# EasyEDA schematic loud-esp-mini-rev-f-schematic.easyeda.json

## Sheets
1 MCU: TITLE: ESP32 audio development board mini; REV: F; Date: 2023-04-20; Sheet: 1/4; Drawn By: andriy@sonocotta.com
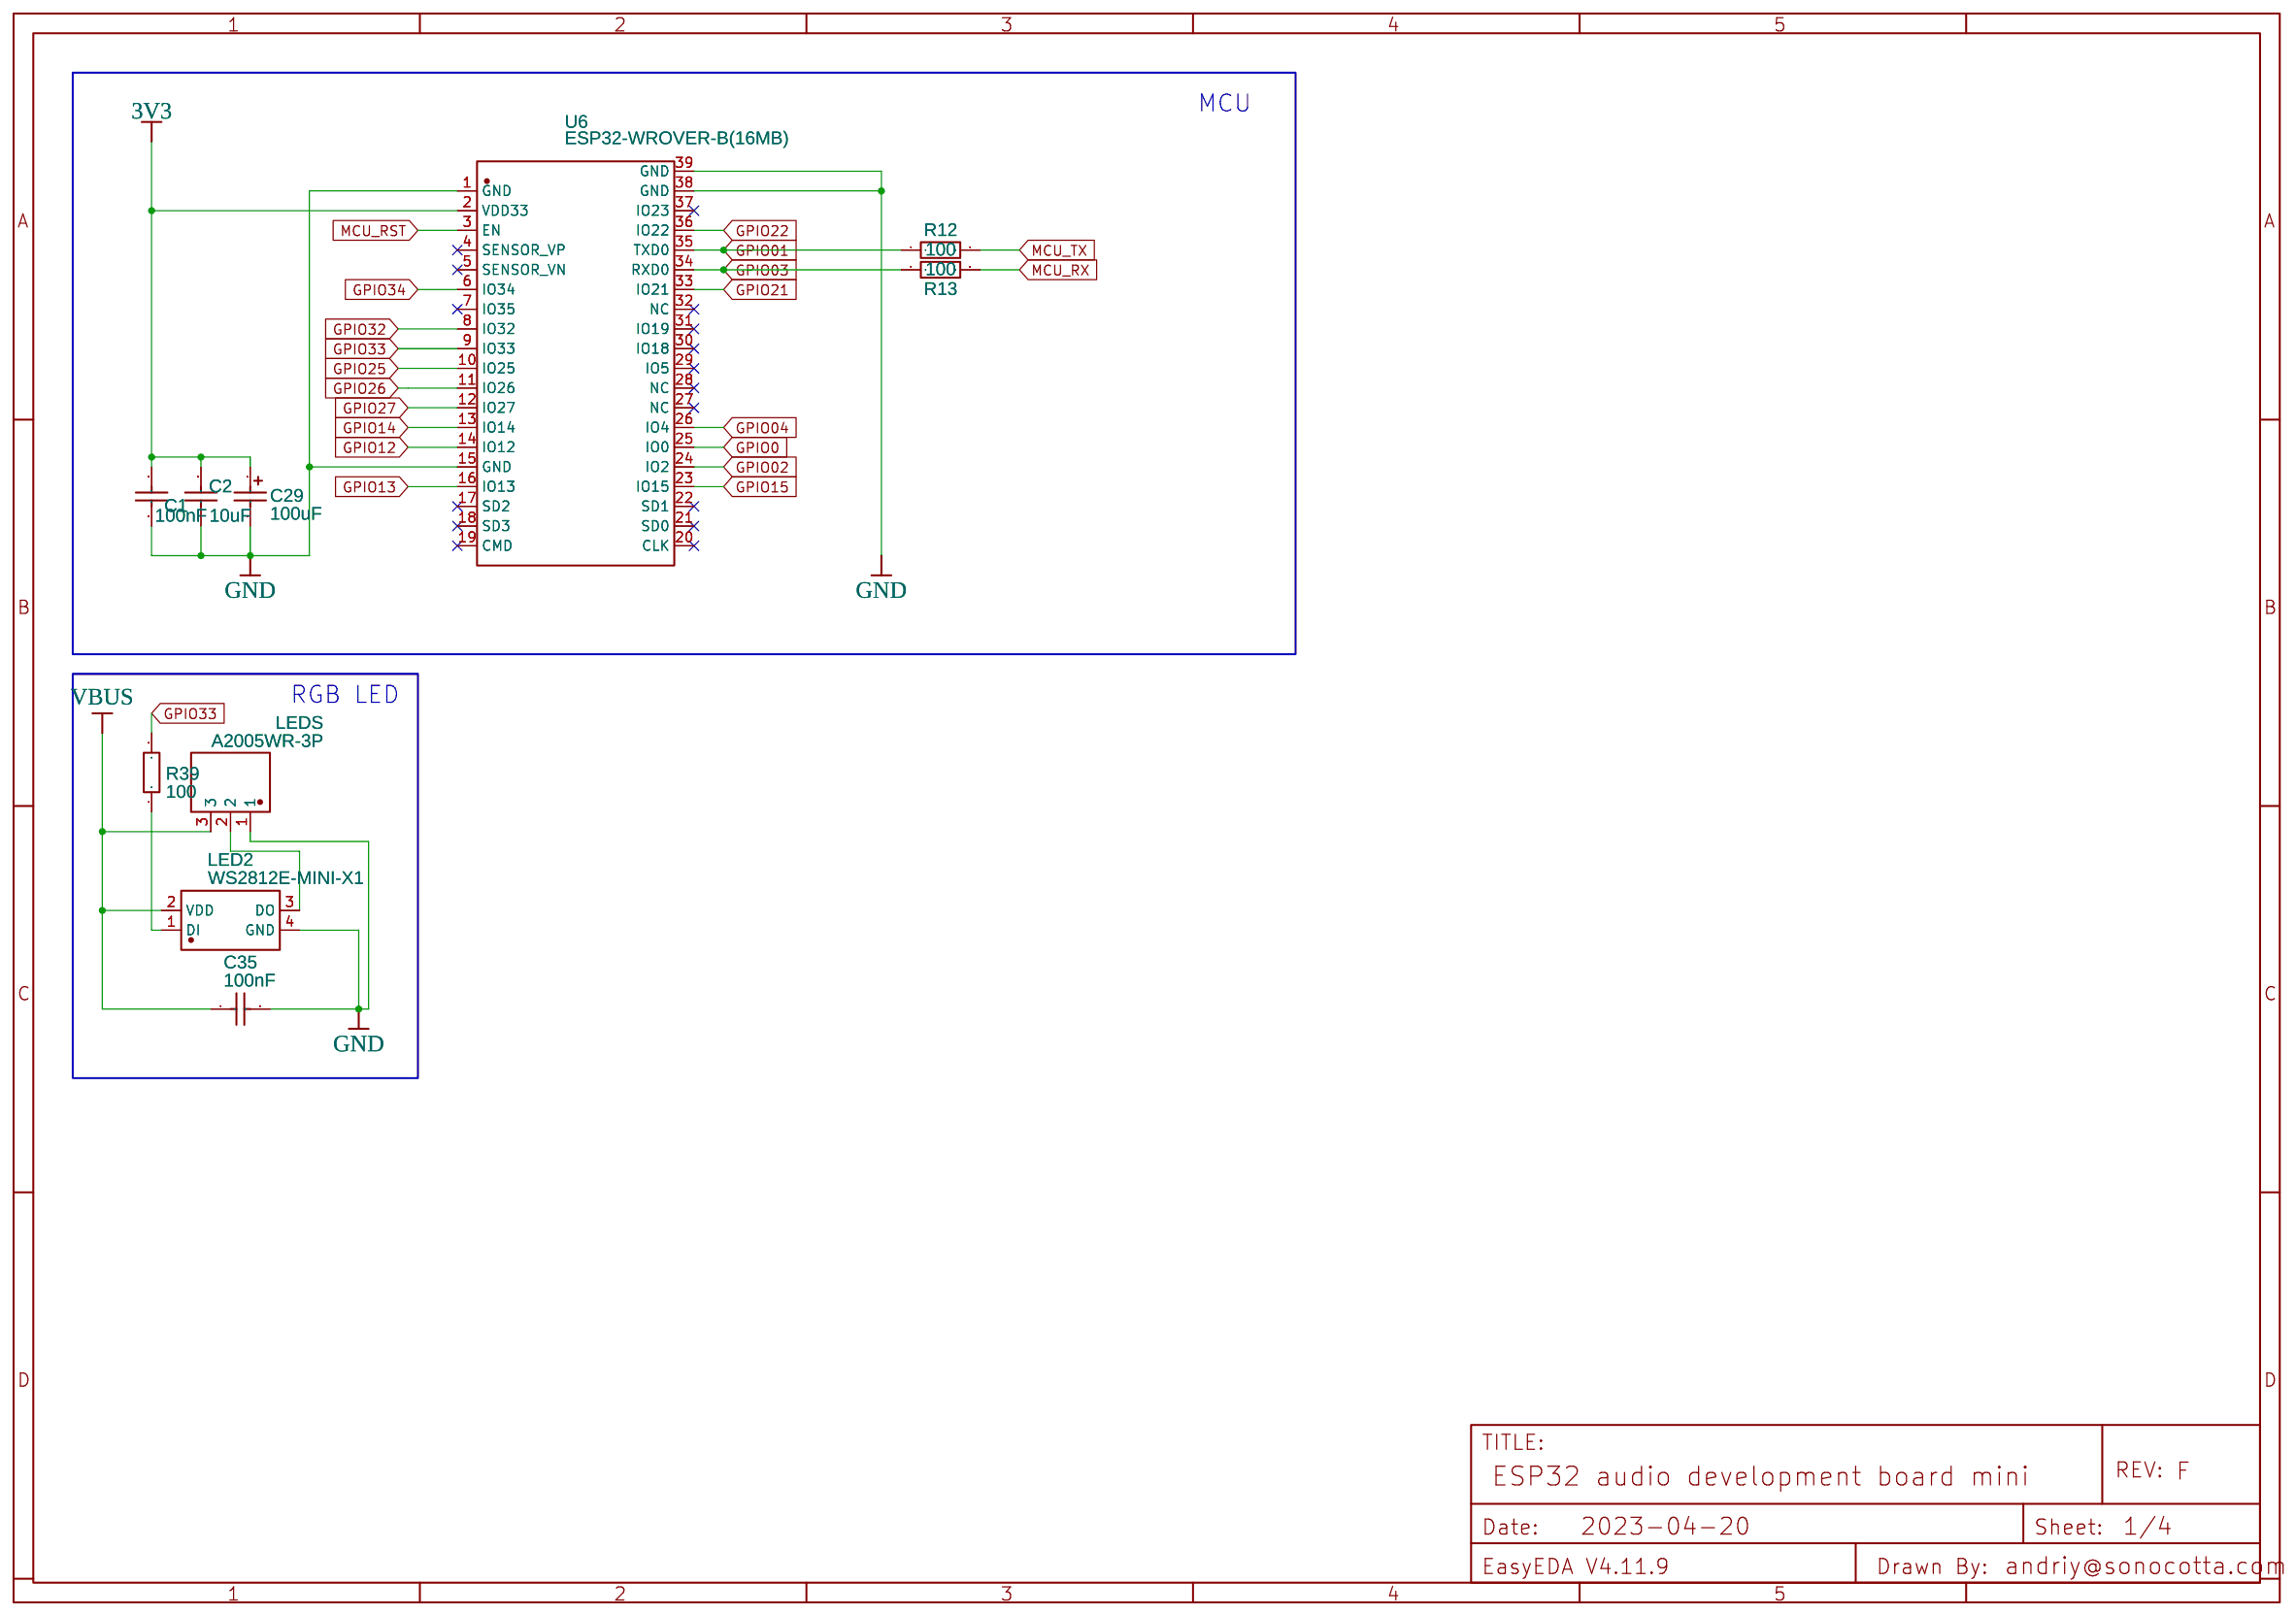
[diagram p0: MCU]
2 SERIAL: Sheet: 2/4; Company: Sonocotta
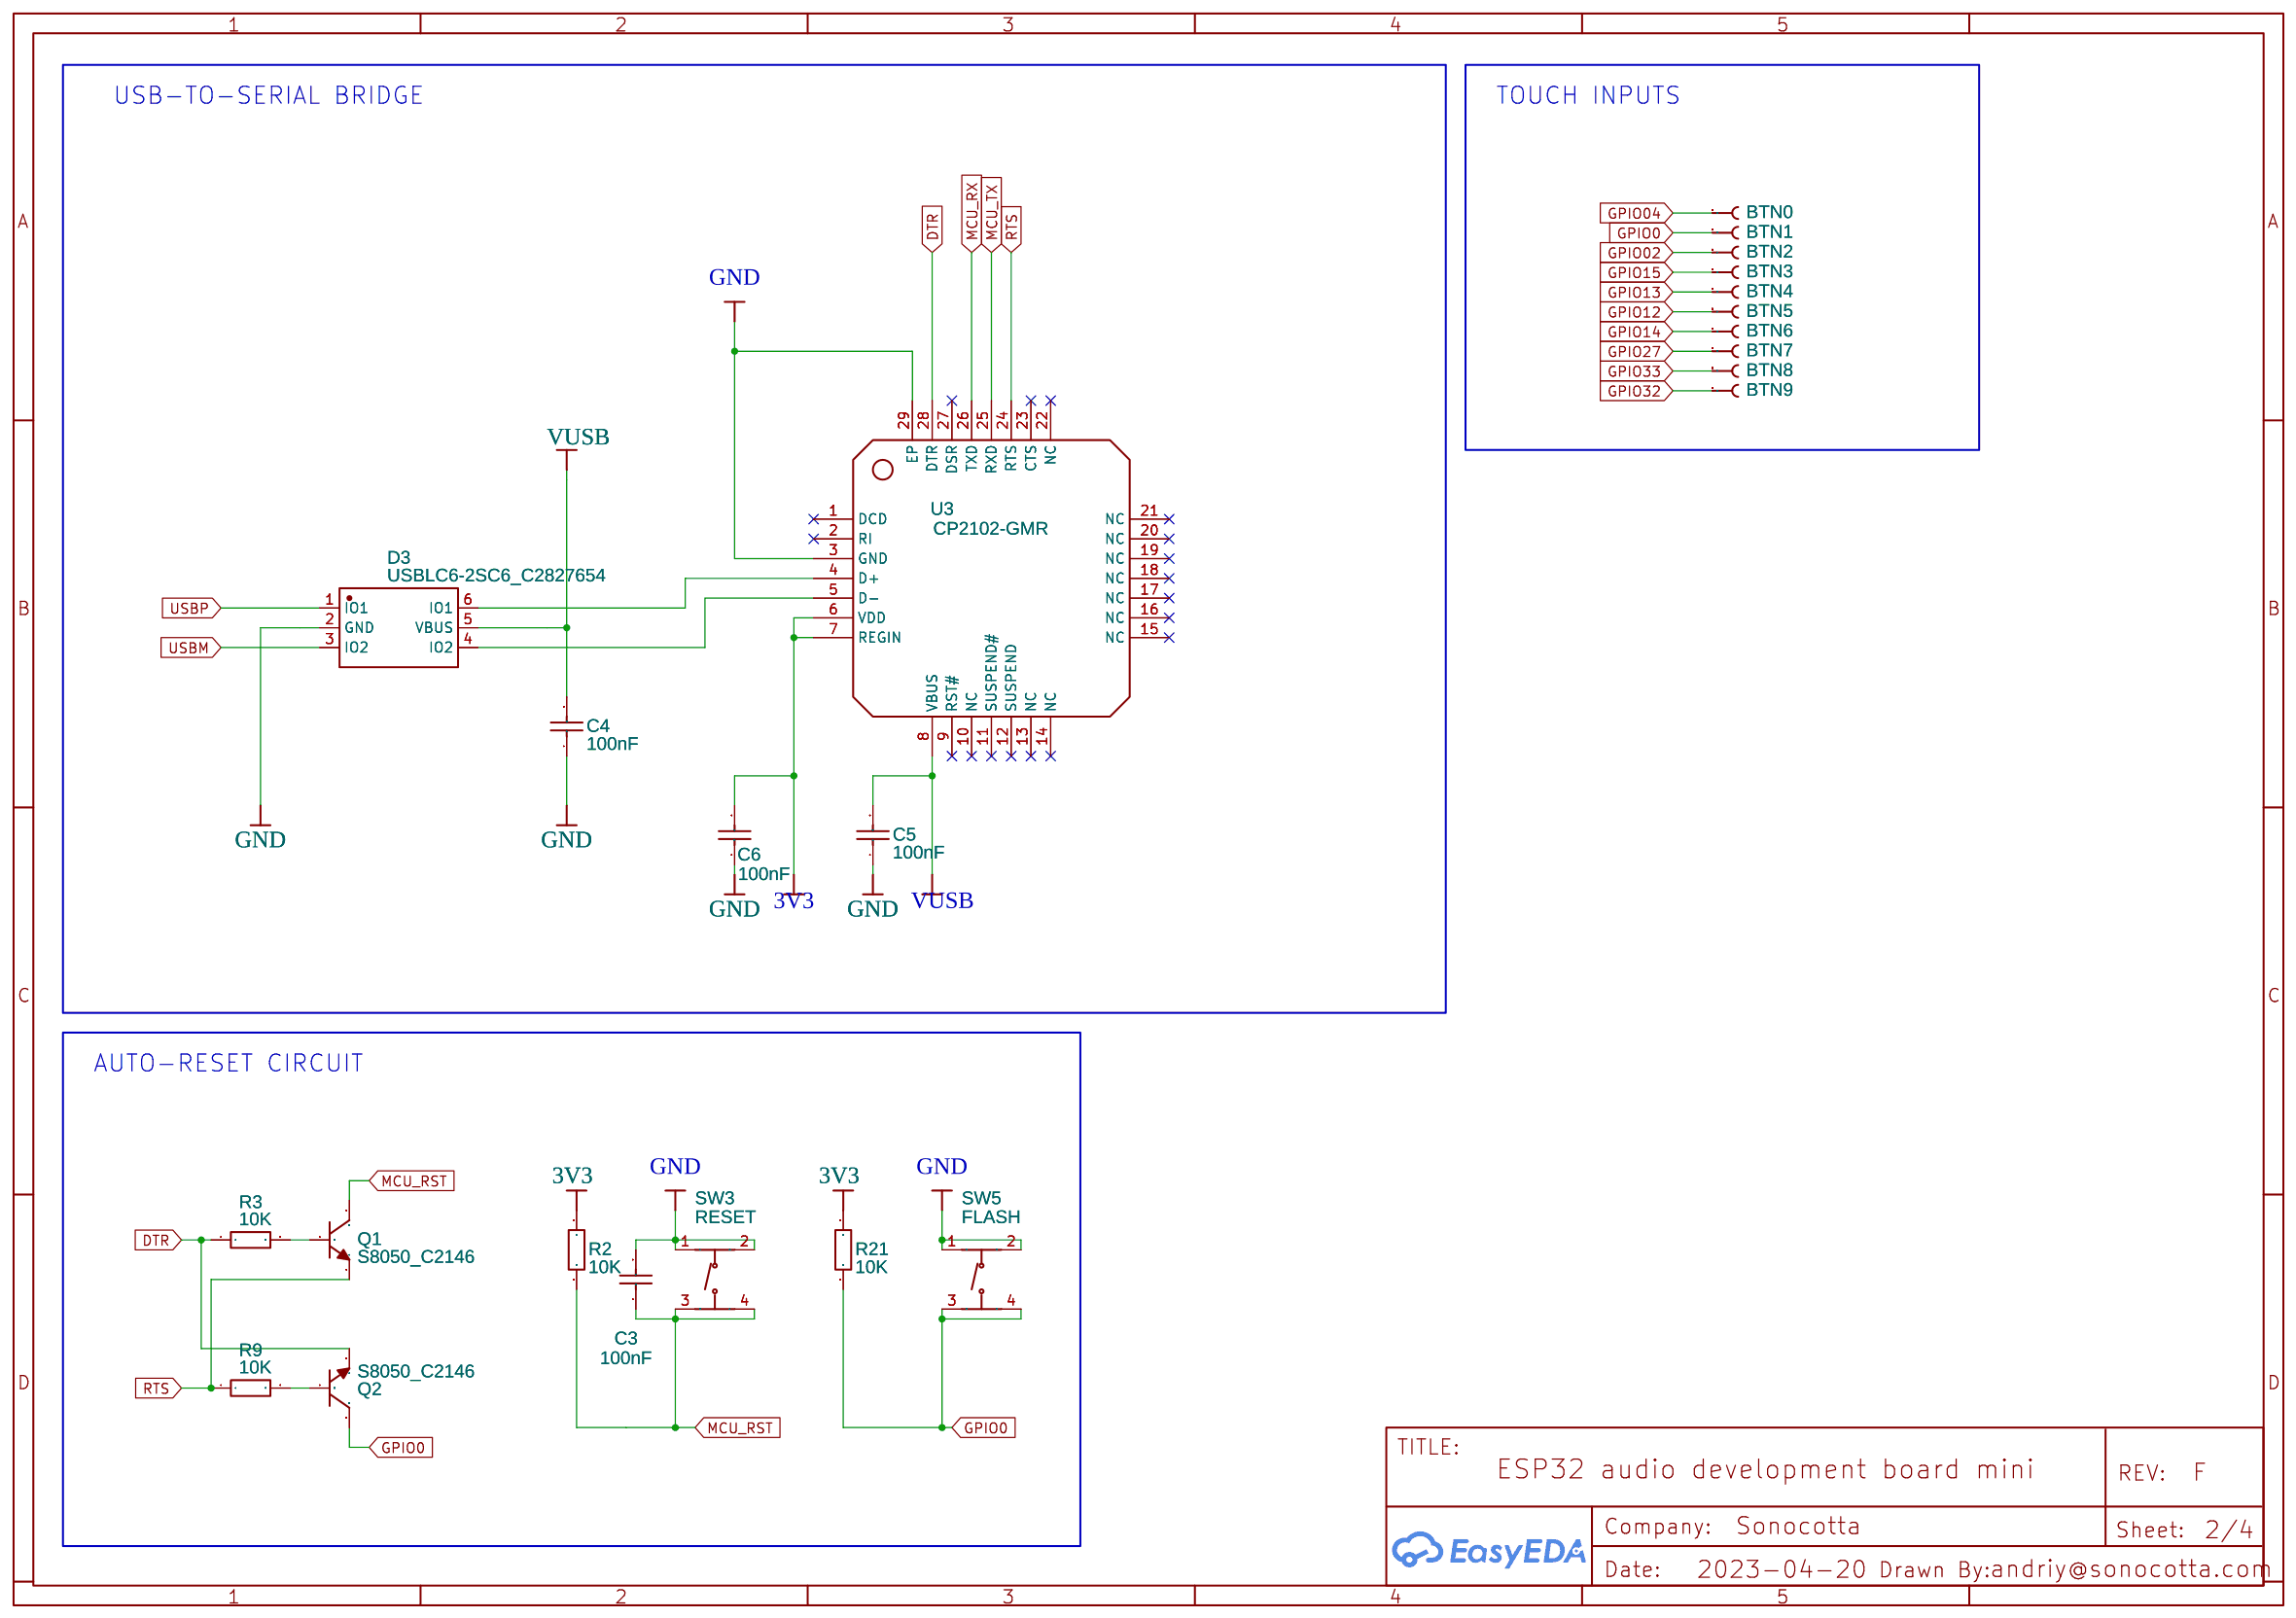
[diagram p1: SERIAL]
3 POWER MGT: Sheet: 3/4; Company: Sonocotta
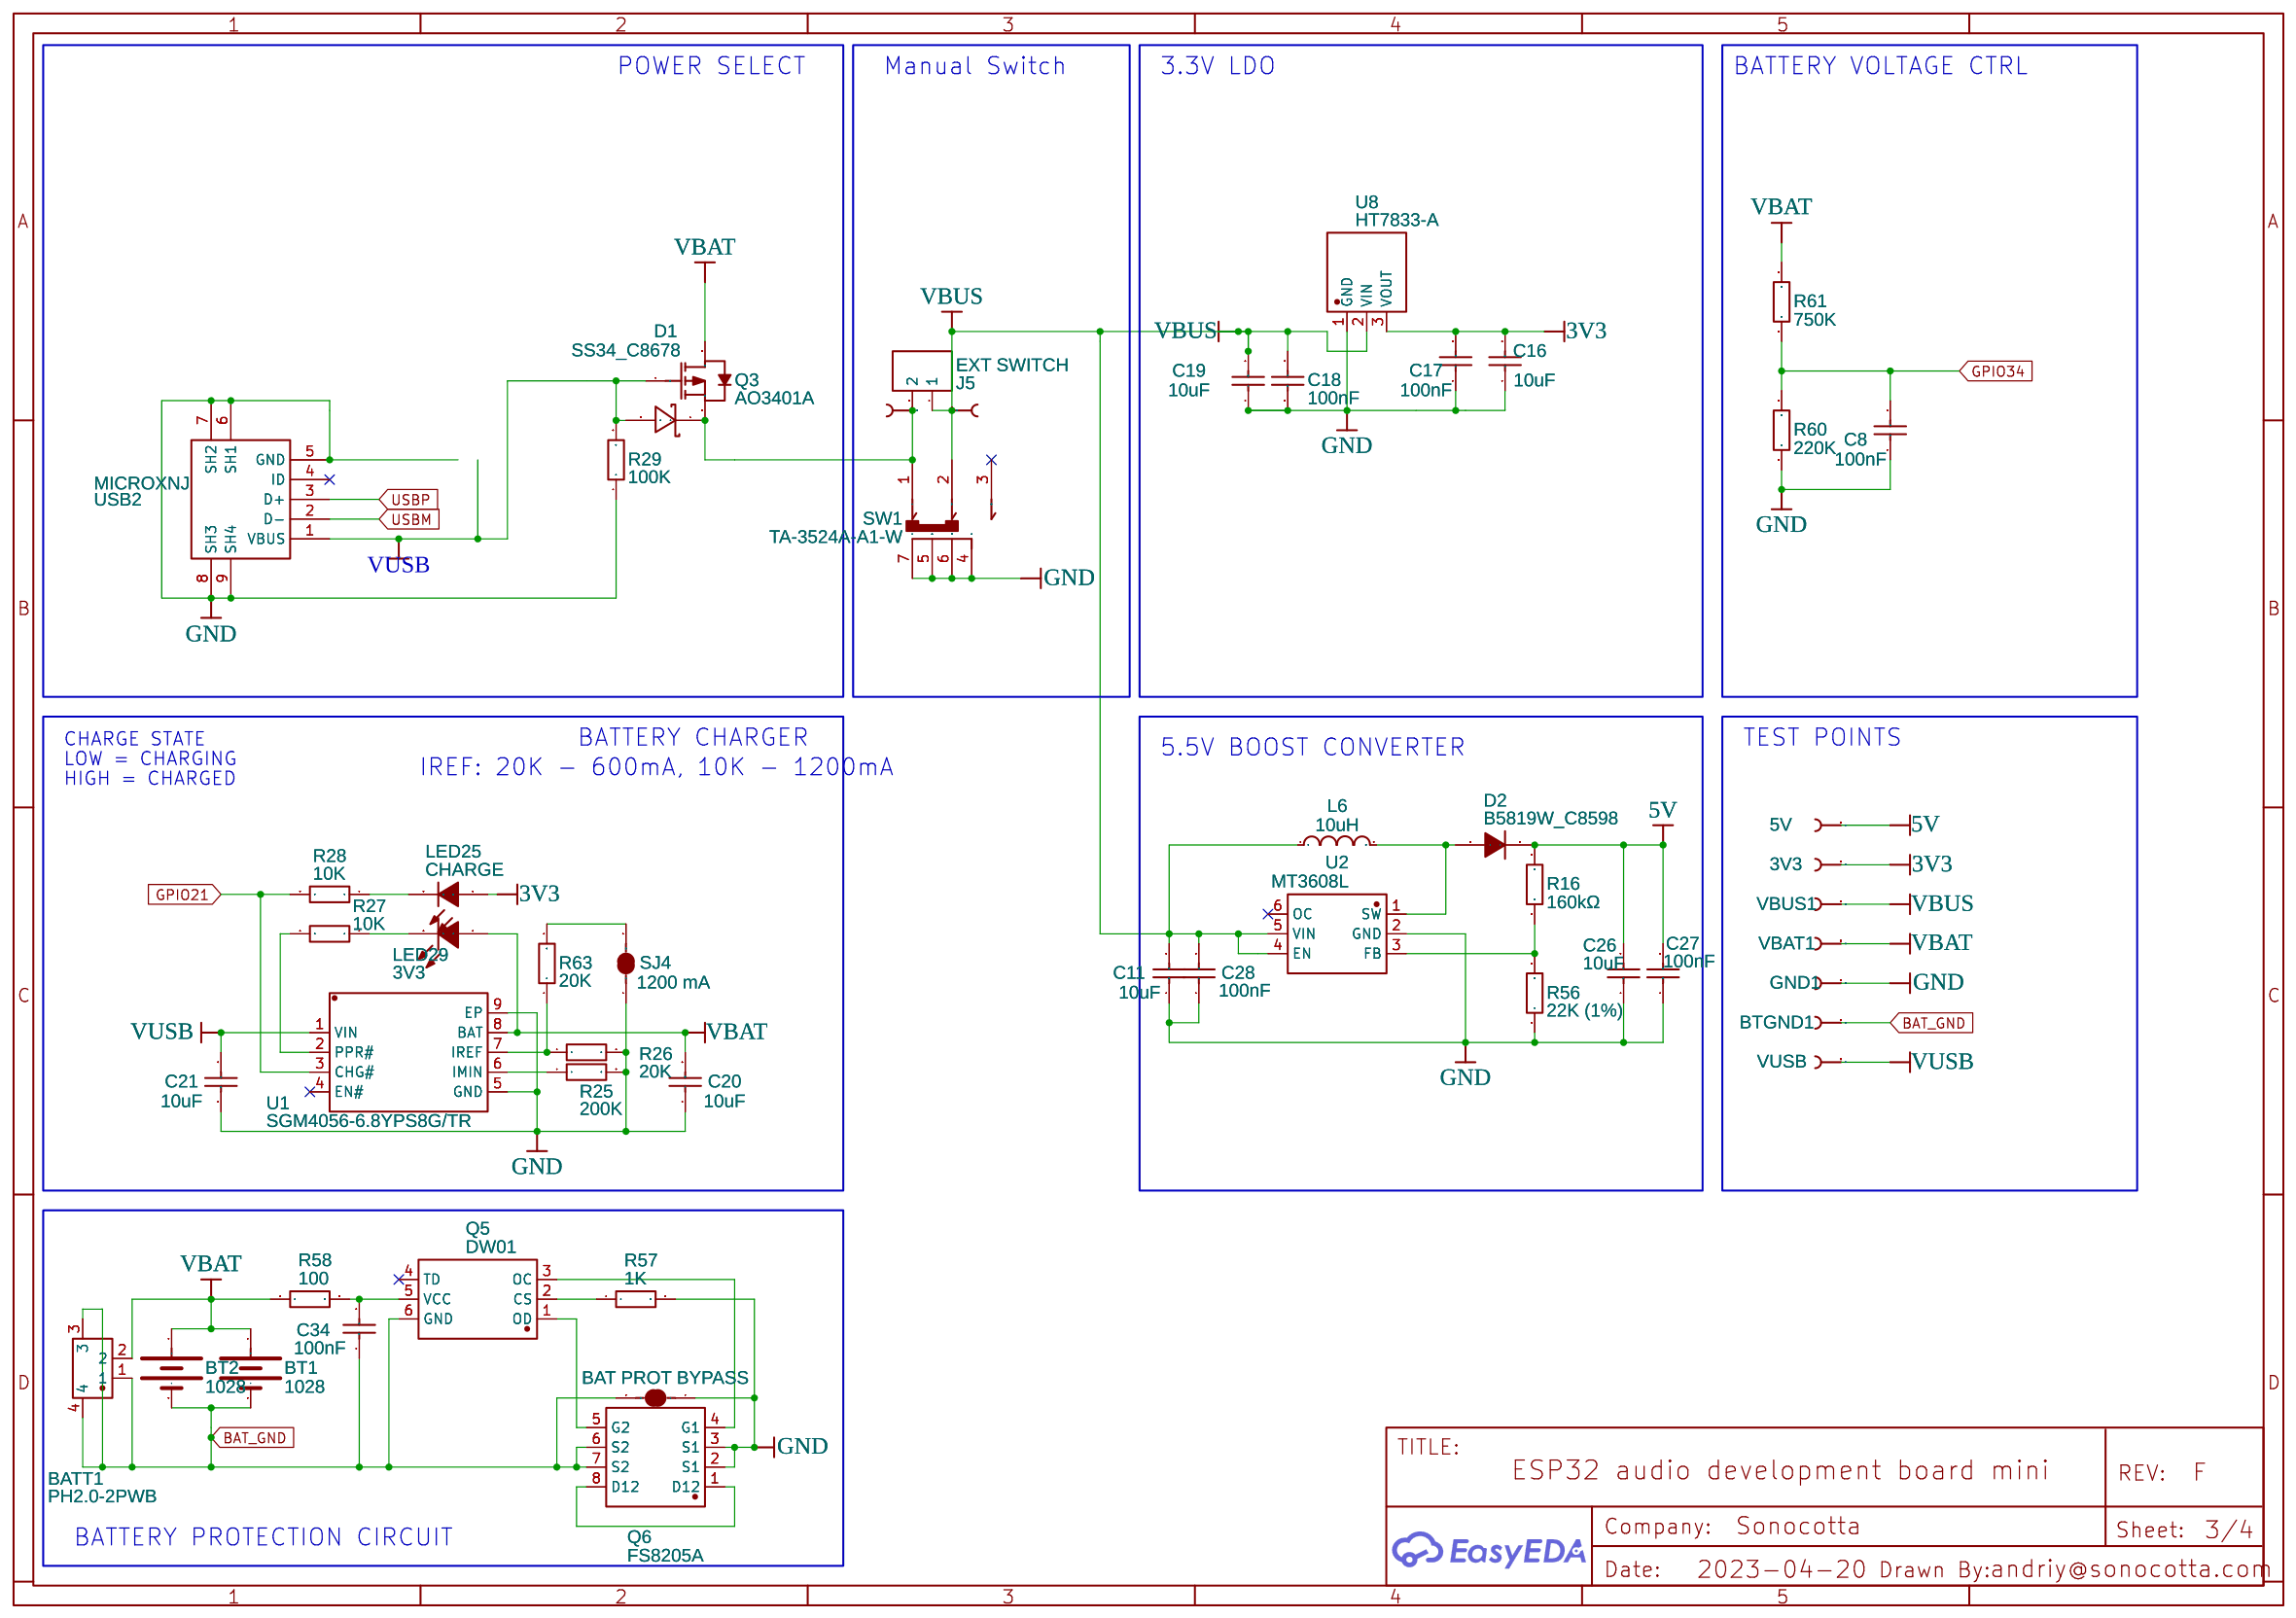
[diagram p2: POWER MGT]
4 DAC: Sheet: 4/4; Company: Sonocotta
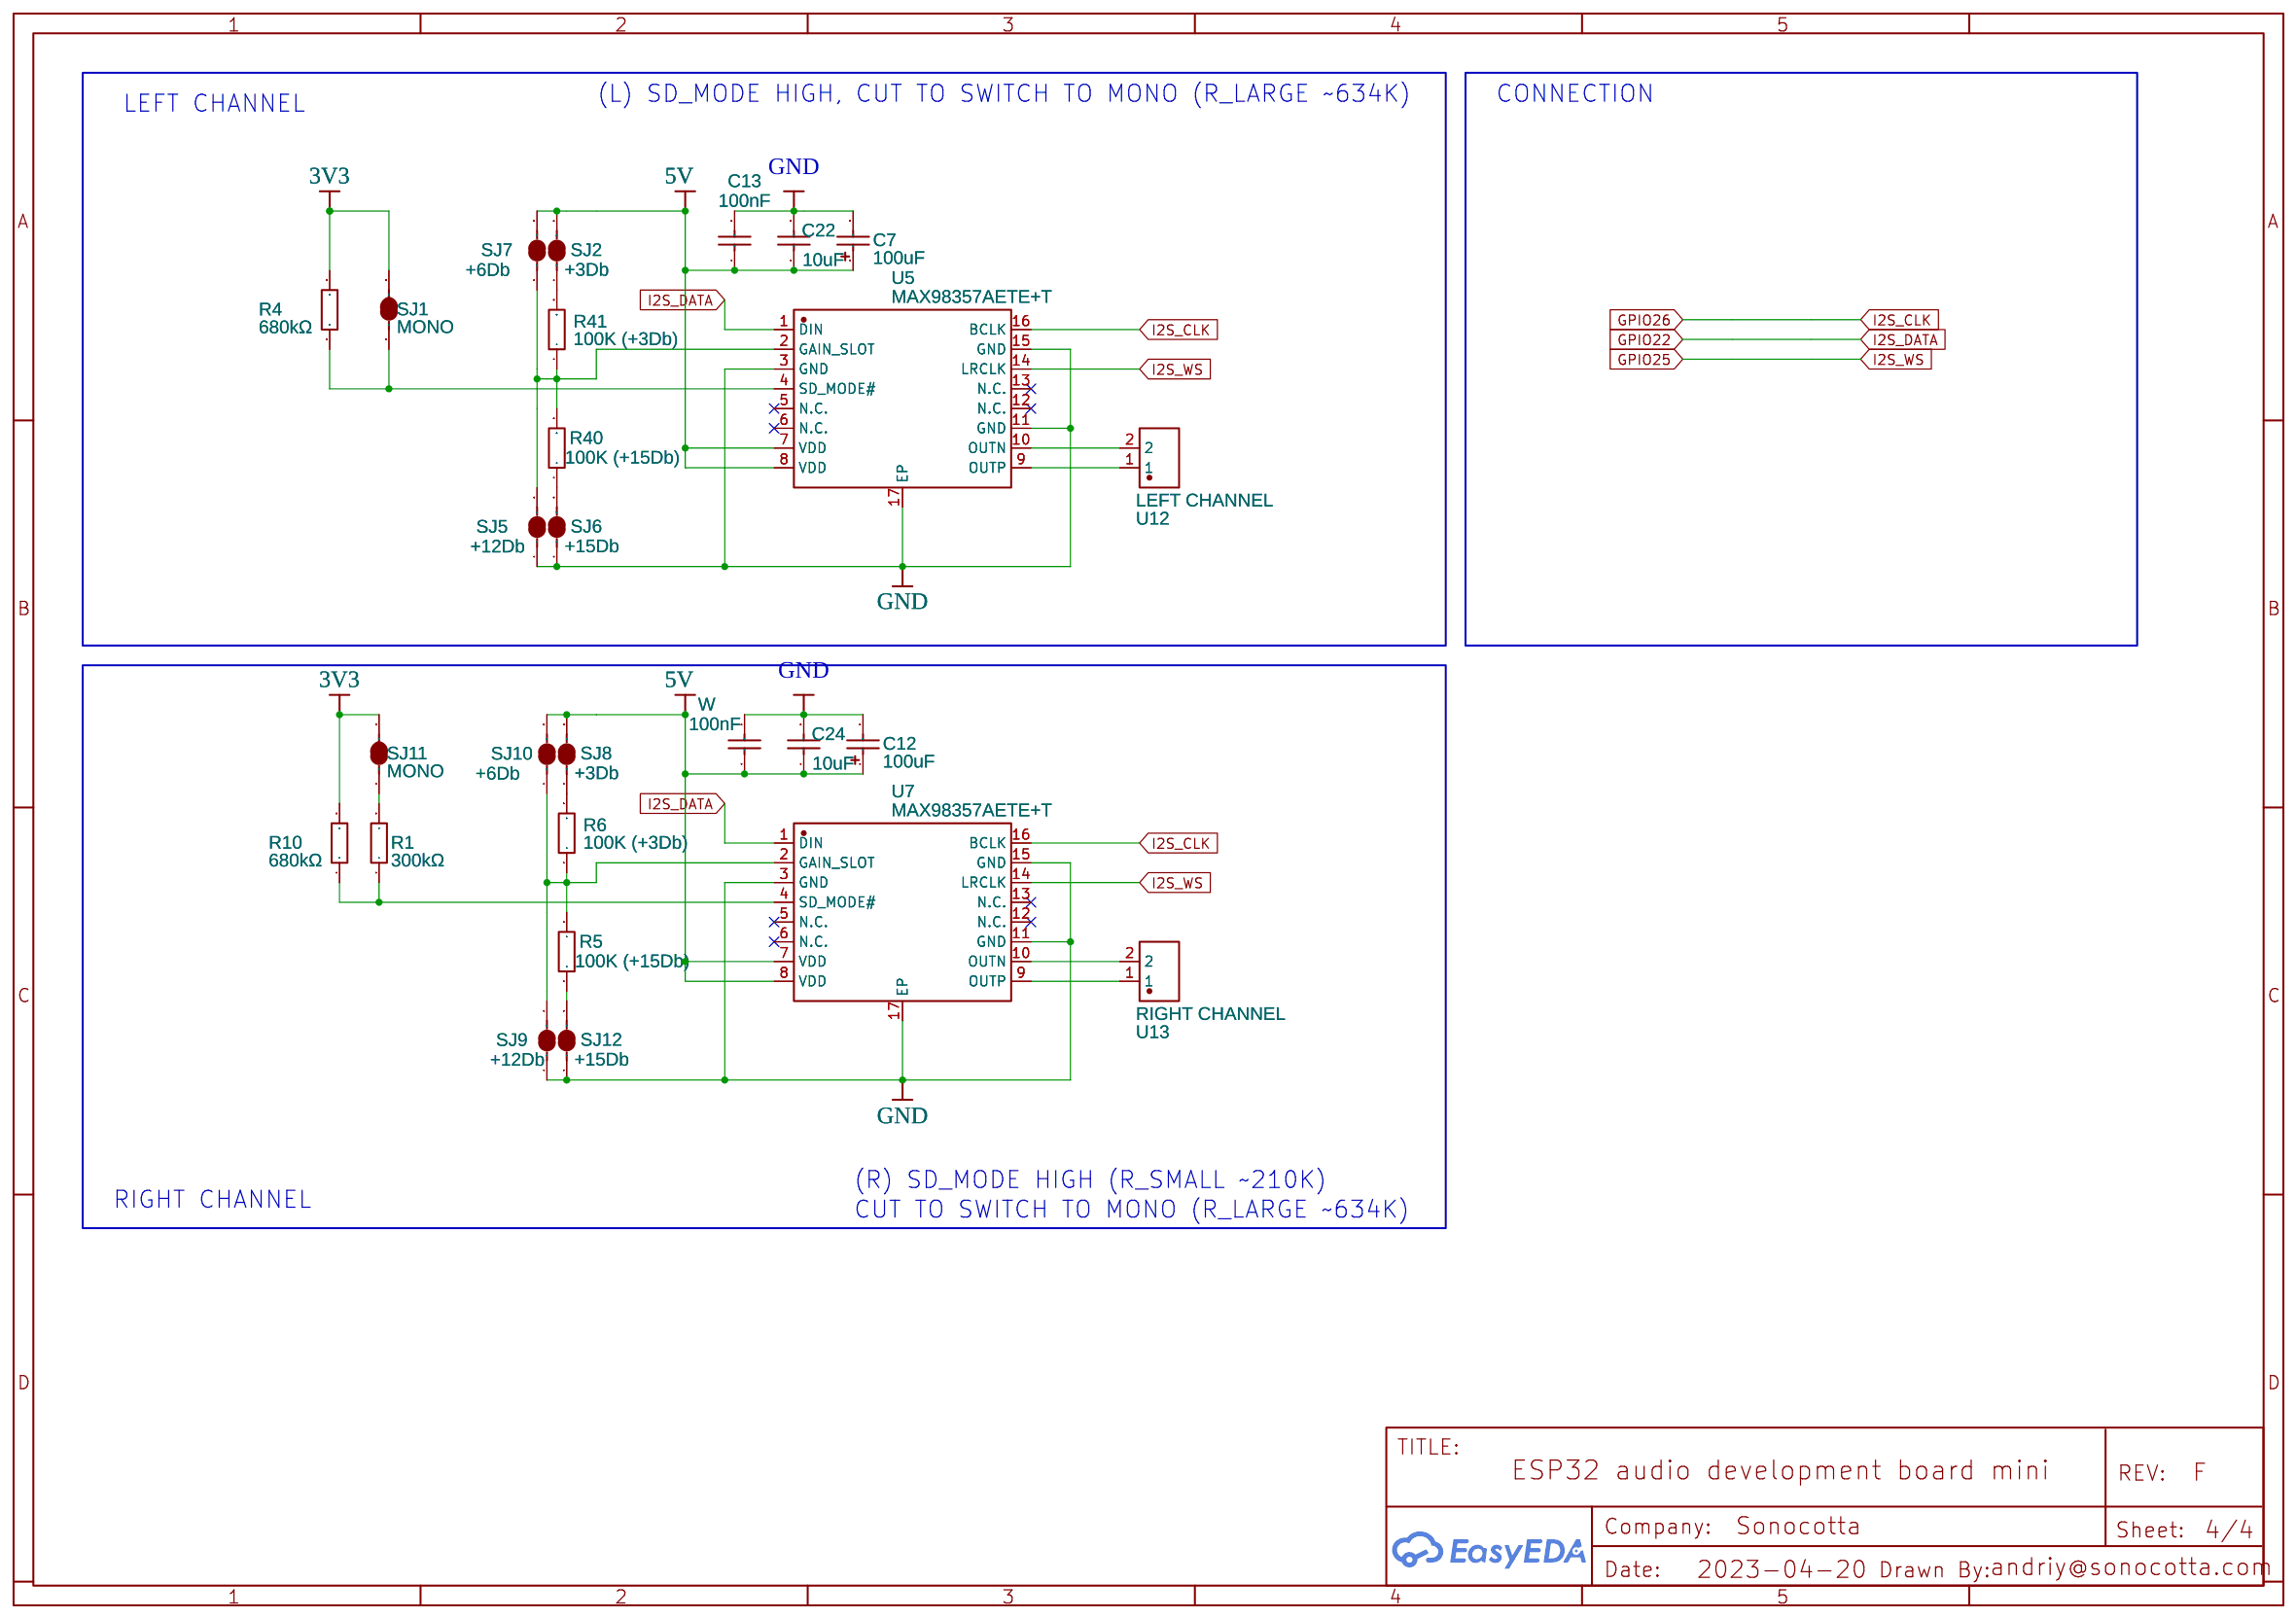
[diagram p3: DAC]

## Parts
sheet DAC
C7  100uF  [CAP-SMD_L3.5-W2.8]
C12  100uF  [CAP-SMD_L3.5-W2.8]
C13  100nF  [C0402]
C22  10uF  [C0805]
C24  10uF  [C0805]
R1  300kΩ  [R0402]
R4  680kΩ  [R0603]
R5  100K (+15Db)  [R0402]
R6  100K (+3Db)  [R0402]
R10  680kΩ  [R0603]
R40  100K (+15Db)  [R0402]
R41  100K (+3Db)  [R0402]
SJ1  MONO  [PAD-JUMPER-2-NC_BY_TRACE_NO_SILK]
SJ2  +3Db  [PAD-JUMPER-2-NO_NO_SILK]
SJ5  +12Db  [PAD-JUMPER-2-NO_NO_SILK]
SJ6  +15Db  [PAD-JUMPER-2-NO_NO_SILK]
SJ7  +6Db  [PAD-JUMPER-2-NO_NO_SILK]
SJ8  +3Db  [PAD-JUMPER-2-NO_NO_SILK]
SJ9  +12Db  [PAD-JUMPER-2-NO_NO_SILK]
SJ10  +6Db  [PAD-JUMPER-2-NO_NO_SILK]
SJ11  MONO  [PAD-JUMPER-2-NC_BY_TRACE_NO_SILK]
SJ12  +15Db  [PAD-JUMPER-2-NO_NO_SILK]
U5  MAX98357AETE+T  [TQFN-16_L3.0-W3.0-P0.50-BL-EP1.5]
U7  MAX98357AETE+T  [TQFN-16_L3.0-W3.0-P0.50-BL-EP1.5]
U12  LEFT CHANNEL  [CONN-TH_P3.50_KF350-3.5-2P]
U13  RIGHT CHANNEL  [CONN-TH_P3.50_KF350-3.5-2P]
W  100nF  [C0402]
sheet MCU
C1  100nF  [C0402]
C2  10uF  [C0805]
C29  100uF  [CAP-SMD_L3.5-W2.8]
C35  100nF  [R0402]
LED2  WS2812E-MINI-X1  [LED-SMD_4P-L3.7-W3.5-P1.75-BR-SK6812MINI]
LEDS  A2005WR-3P  [HDR-TH_3P-P2.00-H-M-W4.0]
R12  100  [R0402]
R13  100  [R0402]
R39  100  [R0402]
U6  ESP32-WROVER-B(16MB)  [WIFIM-SMD_39P-L31.4-W18.0-P1.27]
sheet POWER MGT
3V3  SENSOR CAP 1  [PAD.02X.02]
5V  SENSOR CAP 1  [PAD.02X.02]
BATT1  PH2.0-2PWB  [CONN-SMD_2P-P2.00_PH2.0-SPWB]
BT1  1028  [BAT-TH_KEYSTONE-1028]
BT2  1028  [BAT-TH_KEYSTONE-1028]
BTGND1  SENSOR CAP 1  [PAD.02X.02]
C8  100nF  [C0402]
C11  10uF  [C0805]
C16  10uF  [C0805]
C17  100nF  [C0402]
C18  100nF  [C0402]
C19  10uF  [C0805]
C20  10uF  [C0805]
C21  10uF  [C0805]
C26  10uF  [C0805]
C27  100nF  [C0402]
C28  100nF  [C0402]
C34  100nF  [C0402]
D1  SS34_C8678  [DO-214AC_L4.3-W2.7-LS5.3-RD]
D2  B5819W_C8598  [SOD-123_L2.8-W1.8-LS3.7-RD]
EXT_SW_1  SENSOR CAP 1  [PAD.02X.02]
EXT_SW_2  SENSOR CAP 1  [PAD.02X.02]
GND1  SENSOR CAP 1  [PAD.02X.02]
J5  EXT SWITCH  [HDR-M-2.54_1X2]
L6  10uH  [IND-SMD_L7.0-W6.6]
LED25  CHARGE  [LED0603-R-RD]
LED29  3V3  [LED0603-R-RD]
Q3  AO3401A  [SOT-23_L2.9-W1.3-P1.90-LS2.4-BR]
Q5  DW01  [SOT-23-6_L2.9-W1.6-P0.95-LS2.8-BR]
Q6  FS8205A  [TSSOP-8_L4.4-W3.0-P0.65-LS6.4-BL-2]
R16  160kΩ  [R0603]
R25  200K  [R0402]
R26  20K  [R0402]
R27  10K  [R0402]
R28  10K  [R0402]
R29  100K  [R0402]
R56  22K (1%)  [R0603]
R57  1K  [R0402]
R58  100  [R0402]
R60  220K  [R0603]
R61  750K  [R0603]
R63  20K  [R0402]
SJ3  BAT PROT BYPASS  [PAD-JUMPER-2-NO_NO_SILK]
SJ4  1200 mA  [PAD-JUMPER-2-NO_NO_SILK]
SW1  TA-3524A-A1-W  [CONN-TH_TA-3524A-A2]
U1  SGM4056-6.8YPS8G/TR  [SOIC-8_L4.9-W3.9-P1.27-LS6.0-BL-EP]
U2  MT3608L  [SOT-23-6_L2.9-W1.7-P0.95-LS2.8-BL]
U8  HT7833-A  [SOT-89_L4.5-W2.5-P1.50-LS4.2-BR]
USB2  MICROXNJ  [MICRO-USB-SMD_MICROXNJ]
VBAT1  SENSOR CAP 1  [PAD.02X.02]
VBUS1  SENSOR CAP 1  [PAD.02X.02]
VUSB  SENSOR CAP 1  [PAD.02X.02]
sheet SERIAL
BTN0  SENSOR CAP 1  [PAD.02X.02]
BTN1  SENSOR CAP 1  [PAD.02X.02]
BTN2  SENSOR CAP 1  [PAD.02X.02]
BTN3  SENSOR CAP 1  [PAD.02X.02]
BTN4  SENSOR CAP 1  [PAD.02X.02]
BTN5  SENSOR CAP 1  [PAD.02X.02]
BTN6  SENSOR CAP 1  [PAD.02X.02]
BTN7  SENSOR CAP 1  [PAD.02X.02]
BTN8  SENSOR CAP 1  [PAD.02X.02]
BTN9  SENSOR CAP 1  [PAD.02X.02]
C3  100nF  [C0402]
C4  100nF  [C0402]
C5  100nF  [C0402]
C6  100nF  [C0402]
D3  USBLC6-2SC6_C2827654  [SOT-23-6_L2.9-W1.6-P0.95-LS2.8-BL]
Q1  S8050_C2146  [SOT-23-3_L3.0-W1.7-P0.95-LS2.9-BR]
Q2  S8050_C2146  [SOT-23-3_L3.0-W1.7-P0.95-LS2.9-BR]
R2  10K  [R0402]
R3  10K  [R0402]
R9  10K  [R0402]
R21  10K  [R0402]
SW3  RESET  [SW-SMD_4P-L5.1-W5.1-P3.70-LS6.5-TL-2]
SW5  FLASH  [SW-SMD_4P-L5.1-W5.1-P3.70-LS6.5-TL-2]
U3  CP2102-GMR  [QFN-28_L5.0-W5.0-P0.50-BL-EP]

## Library data of the parts
C7 C12 C29 = TAJB107K006RNJ: Supplier: LCSC; Manufacturer: AVX; Supplier Part: C16133; JLCPCB Part Class: Basic Part
C1 C3-C6 C8 C13 C17 C18 C27 C28 C34 W = CL05B104KO5NNNC: Supplier: LCSC; Manufacturer: SAMSUNG; Supplier Part: C1525; SMT Type: Basic; JLCPCB SMD: Yes; LCSC Assembly: Yes; Paste Type: base
C2 C11 C16 C19-C22 C24 C26 = CL21A106KAYNNNE: Supplier: LCSC; Manufacturer: SAMSUNG; Supplier Part: C15850; SMT Type: Basic; JLCPCB SMD: Yes; LCSC Assembly: Yes; Paste Type: base
R1 = 0402WGF3003TCE: Supplier: LCSC; Manufacturer: UNI-ROYAL(厚声); Supplier Part: C25774; Resistance (Ohms): 300K; JLCPCB Part Class: Basic Part
R4 R10 = 0603WAF6803T5E: Supplier: LCSC; Manufacturer: UNI-ROYAL(厚声); Supplier Part: C25822; Resistance (Ohms): 680K; JLCPCB Part Class: Basic Part
R5 R6 R29 R40 R41 = 0402WGF1003TCE: Supplier: LCSC; Manufacturer: UniOhm; Supplier Part: C25741; JLCPCB Part Class: Basic Part
SJ1 SJ11 = JUMPER-PAD-2-NC_BY_TRACENO_SILK: Contributor: SparkFun
SJ2-SJ10 SJ12 = JUMPER-PAD-2-NO: Contributor: SparkFun
U5 U7 = MAX98357AETE+T: Supplier: LCSC; Supplier Part: C910544; Manufacturer: MAXIM(美信); Contributor: LCSC; JLCPCB Part Class: Extended Part
U12 U13 = KF350-3.5-2P: Supplier: LCSC; Supplier Part: C474892; Manufacturer: Cixi Kefa Elec; Contributor: LCSC; JLCPCB Part Class: Extended Part
C35 = C0201X6S104K6R3NTA: Supplier: LCSC; Supplier Part: C1525; Manufacturer: SAMSUNG; Manufacturer Part: CL05B104KO5NNNC; Contributor: LCSC
LED2 = WS2812E-MINI-X1: Supplier: LCSC; Supplier Part: C4154871; Manufacturer: worldsemi; Contributor: lcsc
LEDS = A2005WR-3P: Supplier: LCSC; Supplier Part: C225270; Manufacturer: Changjiang Connectors; Contributor: LCSC; JLCPCB Part Class: Extended Part
R12 R13 R39 R58 = 0402WGF1000TCE: Supplier: LCSC; Manufacturer: UniOhm; Supplier Part: C25076; JLCPCB Part Class: Basic Part
U6 = ESP32-WROVER-B(16MB): Supplier: LCSC; Supplier Part: C503591; Manufacturer: Espressif Systems; Contributor: LCSC; JLCPCB Part Class: Extended Part
3V3 5V BTGND1 BTN0-BTN9 EXT_SW_1 EXT_SW_2 GND1 VBAT1 VBUS1 VUSB = TEST-POINT2: Bare copper test points for troubleshooting or ICT; Contributor: SparkFun
BATT1 = PH2.0-2PWB: Supplier: LCSC; Manufacturer: BOOMELE; Manufacturer Part: PH2.0-2PWB Horizontal; Supplier Part: C47647; JLCPCB Part Class: Extended Part
BT1 BT2 = 1028: Supplier: LCSC; Supplier Part: C238063; Manufacturer: Keystone; Contributor: LCSC; JLCPCB Part Class: Extended Part
D1 = SS34_C8678: Supplier: LCSC; Manufacturer Part: SS34; Manufacturer: MDD; Supplier Part: C8678; JLCPCB Part Class: Basic Part
D2 = B5819W_C8598: Supplier: LCSC; Manufacturer: CJ; Manufacturer Part: B5819W; image: //image.lceda.cn/szlcsc/C8598.jpg; Supplier Part: C8598; SMT Type: Basic; JLCPCB SMD: Yes; LCSC Assembly: Yes; Paste Type: base
J5 = HDR-M-2.54_1x2: Supplier Part: C124375; Supplier: LCSC; Contributor: LCEDA_Lib
L6 = FXL0630-100-M: Supplier: LCSC; Manufacturer: cjiang; Contributor: LCSC; Supplier Part: C167223; JLCPCB Part Class: Extended Part
LED25 = 19-217/GHC-YR1S2/3T: Supplier: LCSC; Manufacturer: EVERLIGHT; Supplier Part: C72043; JLCPCB Part Class: Basic Part
LED29 = KT-0603R: Supplier: LCSC; Manufacturer: KENTO; image: //image.lceda.cn/szlcsc/C2286.jpg; Supplier Part: C2286; SMT Type: Basic; JLCPCB SMD: Yes; LCSC Assembly: Yes; Paste Type: base
Q3 = AO3401A: Supplier: LCSC; Manufacturer: AOS; Supplier Part: C15127; JLCPCB Part Class: Basic Part
Q5 = DW01: Supplier: LCSC; Manufacturer: Hottech; Contributor: LCSC; Supplier Part: C181096; JLCPCB Part Class: Extended Part
Q6 = FS8205A: Supplier: LCSC; Manufacturer: FORTUNE; Supplier Part: C16052; JLCPCB Part Class: Basic Part
R16 = 0603WAF1603T5E: Supplier: LCSC; Manufacturer: UNI-ROYAL(厚声); Supplier Part: C22813; Resistance (Ohms): 160K; JLCPCB Part Class: Basic Part
R25 = 0402WGF2003TCE: Supplier: LCSC; Manufacturer: UniOhm; Supplier Part: C25764; JLCPCB Part Class: Basic Part
R26 R63 = 0402WGF2002TCE: Supplier: LCSC; Manufacturer: UniOhm; Supplier Part: C25765; JLCPCB Part Class: Basic Part
R2 R3 R9 R21 R27 R28 = 0402WGF1002TCE: Supplier: LCSC; Manufacturer: UniOhm; Supplier Part: C25744; SMT Type: Basic; JLCPCB SMD: Yes; LCSC Assembly: Yes; Paste Type: base
R56 = 0603WAF2202T5E: Supplier: LCSC; Manufacturer: UniOhm; Supplier Part: C31850; JLCPCB Part Class: Basic Part
R57 = 0402WGF1001TCE: Supplier: LCSC; Manufacturer: UniOhm; Supplier Part: C11702; JLCPCB Part Class: Basic Part
R60 = 0603WAF2203T5E: Supplier: LCSC; Manufacturer: UniOhm; Supplier Part: C22961; JLCPCB Part Class: Basic Part
R61 = 0603WAF7503T5E: Supplier: LCSC; Manufacturer: UniOhm; Supplier Part: C23240; JLCPCB Part Class: Basic Part
SW1 = TA-3524A-A1-W: Supplier: LCSC; Supplier Part: C730329; Manufacturer: Yuandi(元迪); Contributor: LCSC; JLCPCB Part Class: Extended Part
U1 = SGM4056-6.8YPS8G/TR: Supplier: LCSC; Manufacturer: SGMICRO; Supplier Part: C79687; JLCPCB Part Class: Extended Part
U2 = MT3608L: Supplier: LCSC; Supplier Part: C2932326; Manufacturer: 西安航天民芯; Contributor: LCSC; JLCPCB Part Class: Extended Part
U8 = HT7833-A: Supplier: LCSC; Supplier Part: C347195; Manufacturer: UMW(Youtai Semiconductor Co., Ltd.); Contributor: LCSC; JLCPCB Part Class: Extended Part
USB2 = MICROXNJ: Supplier: LCSC; Supplier Part: C404969; Manufacturer: SHOU HAN; Manufacturer Part: MicroXNJ; Contributor: LCSC; Paste Type: expand
D3 = USBLC6-2SC6_C2827654: Supplier: LCSC; Supplier Part: C2827654; Manufacturer: TECH PUBLIC(台舟电子); Manufacturer Part: USBLC6-2SC6; Contributor: LCSC
Q1 Q2 = S8050_C2146: Supplier: LCSC; Manufacturer: CJ; Manufacturer Part: S8050; Supplier Part: C2146; JLCPCB Part Class: Basic Part
SW3 SW5 = TS-1187A-B-A-B: Supplier: LCSC; Supplier Part: C318884; Manufacturer: XKB Enterprise; Contributor: LCSC; JLCPCB Part Class: Extended Part
U3 = CP2102-GMR: Supplier: LCSC; Manufacturer: SILICON LABS; Supplier Part: C6568; JLCPCB Part Class: Basic Part

## Nets
3V3: 3V3.P$1(1) C1.2 C2.2 C6.2 C16.2 C17.2 C29.1 LED25.1(A) R2.1 R4.2 R10.2 R21.1 SJ1.2 SJ11.2 U3.6(VDD) U3.7(REGIN) U6.2(VDD33) U8.3(VOUT)
5V: 5V.P$1(1) C7.1 C12.1 C13.1 C22.1 C24.1 C26.2 C27.2 D2.1(-) R16.2 SJ2.2 SJ7.2 SJ8.2 SJ10.2 U5.7(VDD) U5.8(VDD) U7.7(VDD) U7.8(VDD) W.1
GND: C1.1 C2.1 C3.2 C4.1 C5.1 C6.1 C7.2 C8.1 C11.1 C12.2 C13.2 C16.1 C17.1 C18.1 C19.1 C20.1 C21.1 C22.2 C24.2 C26.1 C27.1 C28.1 C29.2 C35.2 D3.2(GND) GND1.P$1(1) LED2.4(GND) LEDS.1 Q6.2(S1) Q6.3(S1) R25.2 R26.2 R29.1 R56.1 R57.2 R60.1 SJ3.1 SJ4.1 SJ5.1 SJ6.1 SJ9.1 SJ12.1 SW1.4 SW1.5 SW1.6 SW1.7 SW3.1(A) SW3.2(B) SW5.1(A) SW5.2(B) U1.5(GND) U1.9(EP) U2.2(GND) U3.3(GND) U3.29(EP) U5.3(GND) U5.11(GND) U5.15(GND) U5.17(EP) U6.1(GND) U6.15(GND) U6.38(GND) U6.39(GND) U7.3(GND) U7.11(GND) U7.15(GND) U7.17(EP) U8.1(GND) USB2.5(GND) USB2.6(SH1) USB2.7(SH2) USB2.8(SH3) USB2.9(SH4) W.2
VBAT: BATT1.2 BT1.1(+) BT2.1(+) C20.2 LED29.1(A) Q3.3(D) R58.1 R61.2 U1.8(BAT) VBAT1.P$1(1)
VBUS: C11.2 C18.2 C19.2 C28.2 C35.1 EXT_SW_2.P$1(1) J5.1 L6.1 LED2.2(VDD) LEDS.3 SW1.2 U2.4(EN) U2.5(VIN) U8.2(VIN) VBUS1.P$1(1)
BAT_GND: BATT1.1 BATT1.3 BATT1.4 BT1.2(-) BT2.2(-) BTGND1.P$1(1) C34.1 Q5.6(GND) Q6.6(S2) Q6.7(S2) SJ3.2
DTR: Q2.2(E) R3.1 U3.28(DTR)
GPIO0: BTN1.P$1(1) Q2.3(C) R21.2 SW5.3(C) SW5.4(D) U6.25(IO0)
GPIO01: R12.1 U6.35(TXD0)
GPIO02: BTN2.P$1(1) U6.24(IO2)
GPIO03: R13.1 U6.34(RXD0)
GPIO04: BTN0.P$1(1) U6.26(IO4)
GPIO12: BTN5.P$1(1) U6.14(IO12)
GPIO13: BTN4.P$1(1) U6.16(IO13)
GPIO14: BTN6.P$1(1) U6.13(IO14)
GPIO15: BTN3.P$1(1) U6.23(IO15)
GPIO21: R28.2 U1.3(CHG#) U6.33(IO21)
GPIO22: U5.1(DIN) U6.36(IO22) U7.1(DIN)
GPIO25: U5.14(LRCLK) U6.10(IO25) U7.14(LRCLK)
GPIO26: U5.16(BCLK) U6.11(IO26) U7.16(BCLK)
GPIO27: BTN7.P$1(1) U6.12(IO27)
GPIO32: BTN9.P$1(1) U6.8(IO32)
GPIO33: BTN8.P$1(1) R39.2 U6.9(IO33)
GPIO34: C8.2 R60.2 R61.1 U6.6(IO34)
MCU_RST: C3.1 Q1.3(C) R2.2 SW3.3(C) SW3.4(D) U6.3(EN)
MCU_RX: R13.2 U3.26(TXD)
MCU_TX: R12.2 U3.25(RXD)
RTS: Q1.2(E) R9.1 U3.24(RTS)
USBM: D3.3(IO2) USB2.2(D-)
USBP: D3.1(IO1) USB2.3(D+)
VUSB: C4.2 C5.2 C21.2 D1.2(A) D3.5(VBUS) Q3.1(G) R29.2 U1.1(VIN) U3.8(VBUS) USB2.1(VBUS) VUSB.P$1(1)
Net-(C34-2): C34.2 Q5.5(VCC) R58.2
Net-(D1-1): D1.1(K) EXT_SW_1.P$1(1) J5.2 Q3.2(S) SW1.1
Net-(D2-2): D2.2(+) L6.2 U2.1(SW)
Net-(D3-4): D3.4(IO2) U3.5(D-)
Net-(D3-6): D3.6(IO1) U3.4(D+)
Net-(LED2-1): LED2.1(DI) R39.1
Net-(LED2-3): LED2.3(DO) LEDS.2
Net-(LED25-2): LED25.2(C) R28.1
Net-(LED29-2): LED29.2(K) R27.1
Net-(Q1-1): Q1.1(B) R3.2
Net-(Q2-1): Q2.1(B) R9.2
Net-(Q5-1): Q5.1(OD) Q6.5(G2)
Net-(Q5-2): Q5.2(CS) R57.1
Net-(Q5-3): Q5.3(OC) Q6.4(G1)
Net-(Q6-1): Q6.1(D12) Q6.8(D12)
Net-(R1-1): R1.1 R10.1 U7.4(SD_MODE#)
Net-(R1-2): R1.2 SJ11.1
Net-(R4-1): R4.1 SJ1.1 U5.4(SD_MODE#)
Net-(R5-1): R5.1 SJ12.2
Net-(R5-2): R5.2 R6.1 SJ9.2 SJ10.1 U7.2(GAIN_SLOT)
Net-(R6-2): R6.2 SJ8.1
Net-(R16-1): R16.1 R56.2 U2.3(FB)
Net-(R25-1): R25.1 U1.6(IMIN)
Net-(R26-1): R26.1 R63.1 U1.7(IREF)
Net-(R27-2): R27.2 U1.2(PPR#)
Net-(R40-1): R40.1 SJ6.2
Net-(R40-2): R40.2 R41.1 SJ5.2 SJ7.1 U5.2(GAIN_SLOT)
Net-(R41-2): R41.2 SJ2.1
Net-(R63-2): R63.2 SJ4.2
Net-(U5-9): U5.9(OUTP) U12.1
Net-(U5-10): U5.10(OUTN) U12.2
Net-(U7-9): U7.9(OUTP) U13.1
Net-(U7-10): U7.10(OUTN) U13.2

Not connected (* = marked no-connect by the designer): Q5 4(TD)*; SW1 3*; U1 4(EN#)*; U2 6(OC)*; U3 1(DCD)* 2(RI)* 9(RST#)* 10(NC)* 11(SUSPEND#)* 12(SUSPEND)* 13(NC)* 14(NC)* 15(NC)* 16(NC)* 17(NC)* 18(NC)* 19(NC)* 20(NC)* 21(NC)* 22(NC)* 23(CTS)* 27(DSR)*; U5 5(N.C.)* 6(N.C.)* 12(N.C.)* 13(N.C.)*; U6 4(SENSOR_VP)* 5(SENSOR_VN)* 7(IO35)* 17(SD2)* 18(SD3)* 19(CMD)* 20(CLK)* 21(SD0)* 22(SD1)* 27(NC)* 28(NC)* 29(IO5)* 30(IO18)* 31(IO19)* 32(NC)* 37(IO23)*; U7 5(N.C.)* 6(N.C.)* 12(N.C.)* 13(N.C.)*; USB2 4(ID)*

## Notes on the sheets
sheet 1
- MCU
- RGB LED
sheet 2
- USB-TO-SERIAL BRIDGE
- TOUCH INPUTS
- AUTO-RESET CIRCUIT
sheet 3
- POWER SELECT
- Manual Switch
- 3.3V LDO
- BATTERY VOLTAGE CTRL
- CHARGE STATE
- BATTERY CHARGER
- 5.5V BOOST CONVERTER
- TEST POINTS
- HIGH = CHARGED
- LOW = CHARGING
- IREF: 20K - 600mA, 10K - 1200mA
- BATTERY PROTECTION CIRCUIT
sheet 4
- (L) SD_MODE HIGH, CUT TO SWITCH TO MONO (R_LARGE ~634K)
- CONNECTION
- LEFT CHANNEL
- RIGHT CHANNEL
- (R) SD_MODE HIGH (R_SMALL ~210K)
- CUT TO SWITCH TO MONO (R_LARGE ~634K)
